# EAGLE design front-panel-module-revC (EAGLE 5.11)
DRAWN_BY: Alexios; PROJECT_NAME: CFT Mini-Computer; REVISION: Rev C; SHEET_DESCRIPTION: Front Panel LED Module; SIMULATION_FILENAME: N/A; URL: http://www.bedroomlan.org/cft
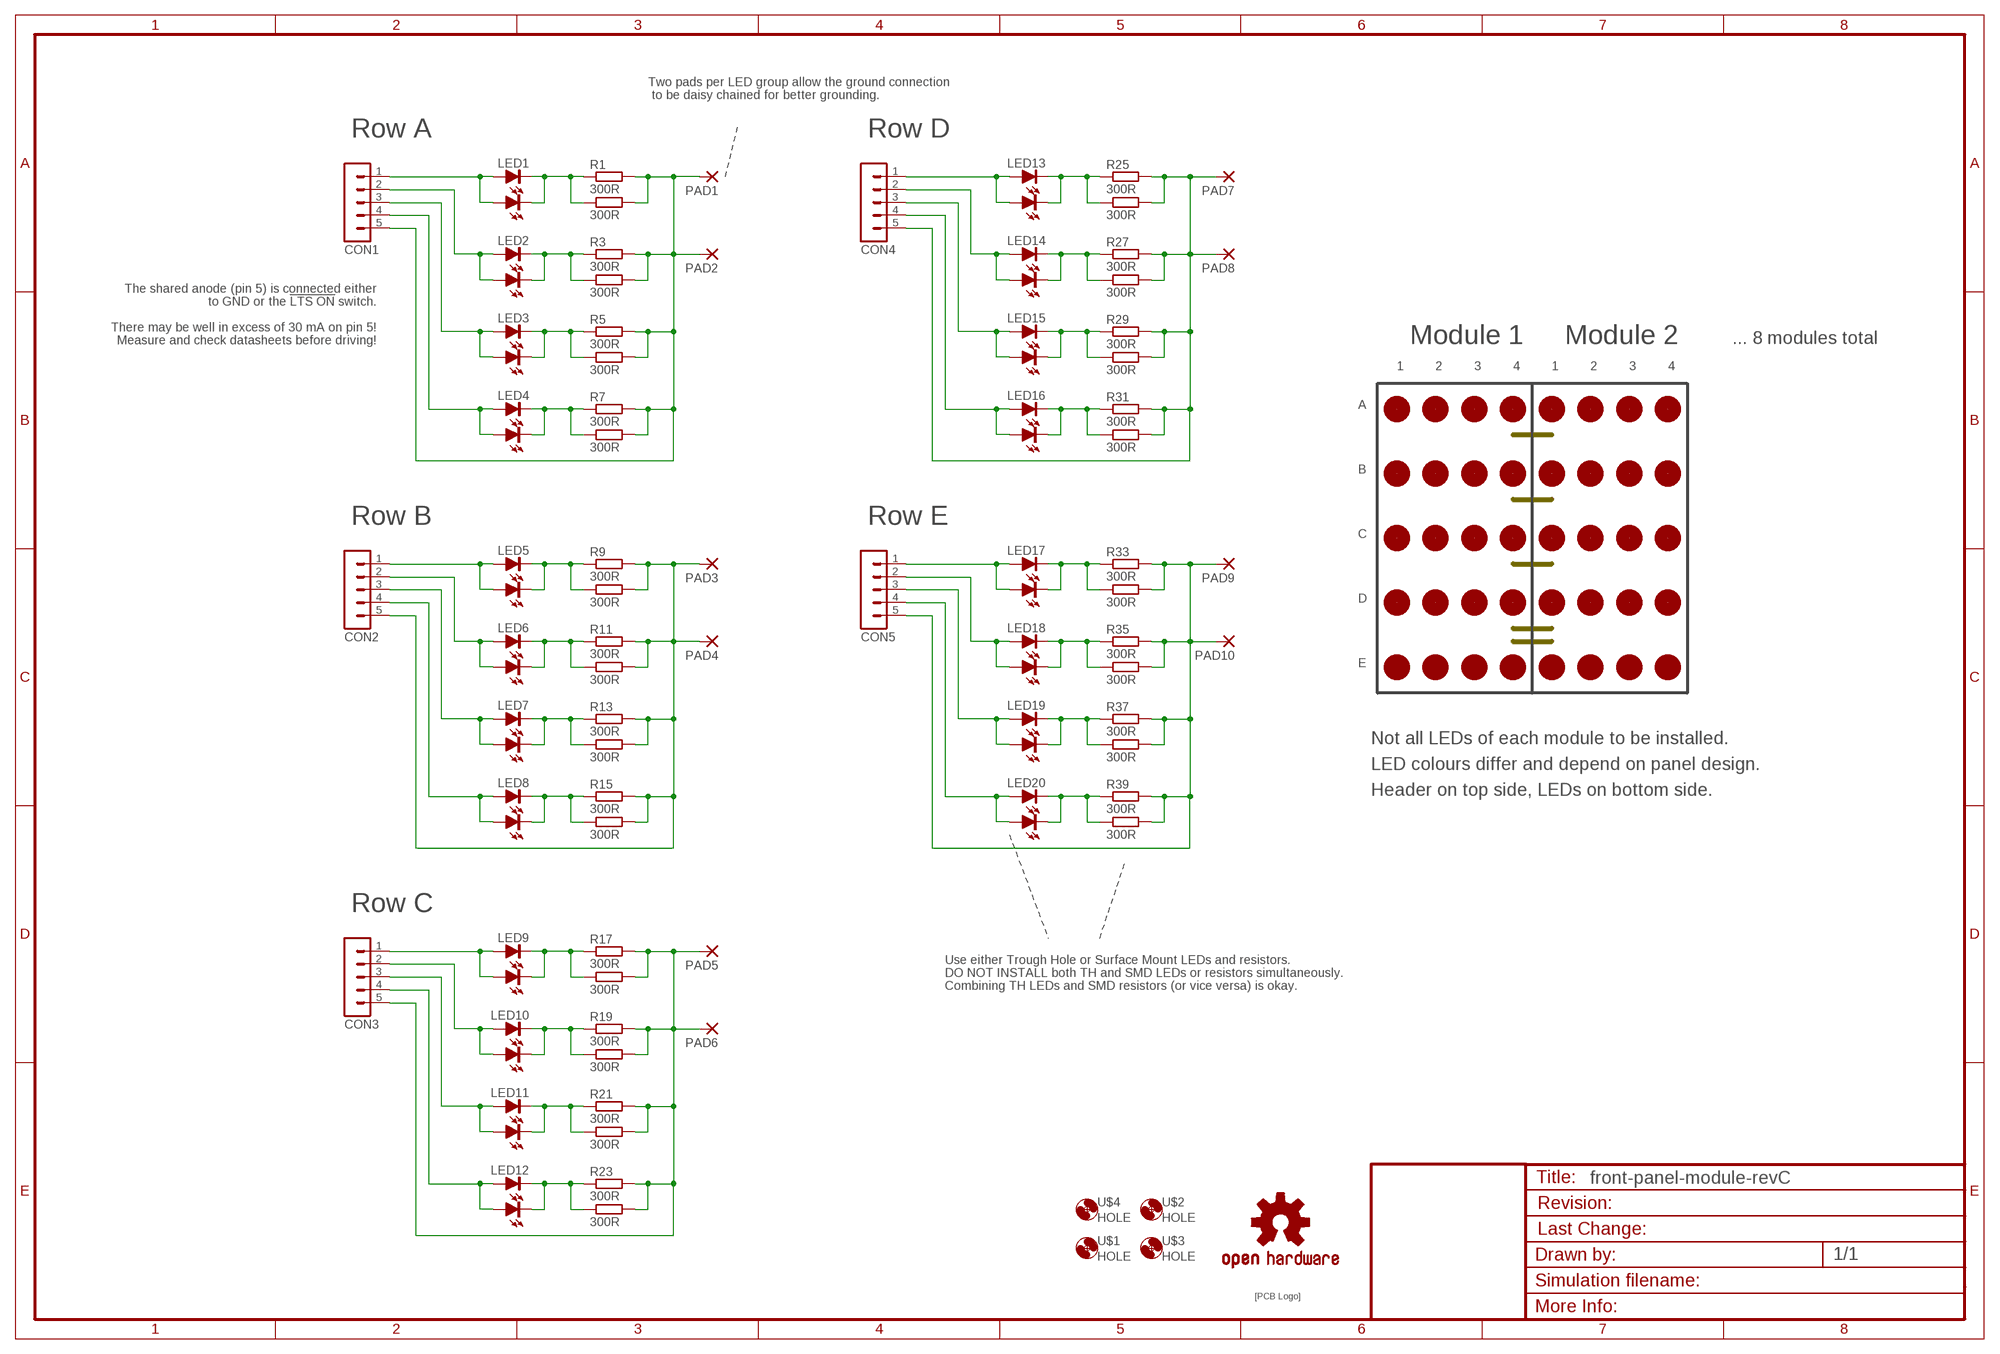
[diagram p0: schematic, sheet 1]

## Parts
$4_39_$  OSHW-LOGOL  [OSHW-LOGO-L]
CON1  MA05-1  [MA05-1]
CON2  MA05-1  [MA05-1]
CON3  MA05-1  [MA05-1]
CON4  MA05-1  [MA05-1]
CON5  MA05-1  [MA05-1]
LED1  LED-5MM-RED  [LED5MM@1]
LED1B  LEDKA-3528ASYC  [KA-3528ASYC]
LED2  LED-5MM-RED  [LED5MM@1]
LED2B  LEDKA-3528ASYC  [KA-3528ASYC]
LED3  LED-5MM-RED  [LED5MM@1]
LED3B  LEDKA-3528ASYC  [KA-3528ASYC]
LED4  LED-5MM-RED  [LED5MM@1]
LED4B  LEDKA-3528ASYC  [KA-3528ASYC]
LED5  LED-5MM-RED  [LED5MM@1]
LED5B  LEDKA-3528ASYC  [KA-3528ASYC]
LED6  LED-5MM-RED  [LED5MM@1]
LED6B  LEDKA-3528ASYC  [KA-3528ASYC]
LED7  LED-5MM-RED  [LED5MM@1]
LED7B  LEDKA-3528ASYC  [KA-3528ASYC]
LED8  LED-5MM-RED  [LED5MM@1]
LED8B  LEDKA-3528ASYC  [KA-3528ASYC]
LED9  LED-5MM-RED  [LED5MM@1]
LED9B  LEDKA-3528ASYC  [KA-3528ASYC]
LED10  LED-5MM-RED  [LED5MM@1]
LED10B  LEDKA-3528ASYC  [KA-3528ASYC]
LED11  LED-5MM-RED  [LED5MM@1]
LED11B  LEDKA-3528ASYC  [KA-3528ASYC]
LED12  LED-5MM-RED  [LED5MM@1]
LED12B  LEDKA-3528ASYC  [KA-3528ASYC]
LED13  LED-5MM-RED  [LED5MM@1]
LED13B  LEDKA-3528ASYC  [KA-3528ASYC]
LED14  LED-5MM-RED  [LED5MM@1]
LED14B  LEDKA-3528ASYC  [KA-3528ASYC]
LED15  LED-5MM-RED  [LED5MM@1]
LED15B  LEDKA-3528ASYC  [KA-3528ASYC]
LED16  LED-5MM-RED  [LED5MM@1]
LED16B  LEDKA-3528ASYC  [KA-3528ASYC]
LED17  LED-5MM-RED  [LED5MM@1]
LED17B  LEDKA-3528ASYC  [KA-3528ASYC]
LED18  LED-5MM-RED  [LED5MM@1]
LED18B  LEDKA-3528ASYC  [KA-3528ASYC]
LED19  LED-5MM-RED  [LED5MM@1]
LED19B  LEDKA-3528ASYC  [KA-3528ASYC]
LED20  LED-5MM-RED  [LED5MM@1]
LED20B  LEDKA-3528ASYC  [KA-3528ASYC]
PAD1  2,54/1,1  [2,54/1,1]
PAD2  2,54/1,1  [2,54/1,1]
PAD3  2,54/1,1  [2,54/1,1]
PAD4  2,54/1,1  [2,54/1,1]
PAD5  2,54/1,1  [2,54/1,1]
PAD6  2,54/1,1  [2,54/1,1]
PAD7  2,54/1,1  [2,54/1,1]
PAD8  2,54/1,1  [2,54/1,1]
PAD9  2,54/1,1  [2,54/1,1]
PAD10  2,54/1,1  [2,54/1,1]
R1  300R  R-EU_M0805  [M0805]
R2  300R  R-EU_0204/7  [0204/7]
R3  300R  R-EU_M0805  [M0805]
R4  300R  R-EU_0204/7  [0204/7]
R5  300R  R-EU_M0805  [M0805]
R6  300R  R-EU_0204/7  [0204/7]
R7  300R  R-EU_M0805  [M0805]
R8  300R  R-EU_0204/7  [0204/7]
R9  300R  R-EU_M0805  [M0805]
R10  300R  R-EU_0204/7  [0204/7]
R11  300R  R-EU_M0805  [M0805]
R12  300R  R-EU_0204/7  [0204/7]
R13  300R  R-EU_M0805  [M0805]
R14  300R  R-EU_0204/7  [0204/7]
R15  300R  R-EU_M0805  [M0805]
R16  300R  R-EU_0204/7  [0204/7]
R17  300R  R-EU_M0805  [M0805]
R18  300R  R-EU_0204/7  [0204/7]
R19  300R  R-EU_M0805  [M0805]
R20  300R  R-EU_0204/7  [0204/7]
R21  300R  R-EU_M0805  [M0805]
R22  300R  R-EU_0204/7  [0204/7]
R23  300R  R-EU_M0805  [M0805]
R24  300R  R-EU_0204/7  [0204/7]
R25  300R  R-EU_M0805  [M0805]
R26  300R  R-EU_0204/7  [0204/7]
R27  300R  R-EU_M0805  [M0805]
R28  300R  R-EU_0204/7  [0204/7]
R29  300R  R-EU_M0805  [M0805]
R30  300R  R-EU_0204/7  [0204/7]
R31  300R  R-EU_M0805  [M0805]
R32  300R  R-EU_0204/7  [0204/7]
R33  300R  R-EU_M0805  [M0805]
R34  300R  R-EU_0204/7  [0204/7]
R35  300R  R-EU_M0805  [M0805]
R36  300R  R-EU_0204/7  [0204/7]
R37  300R  R-EU_M0805  [M0805]
R38  300R  R-EU_0204/7  [0204/7]
R39  300R  R-EU_M0805  [M0805]
R40  300R  R-EU_0204/7  [0204/7]
U$1  HOLE  [STANDOFF_28_60]
U$2  HOLE  [STANDOFF_28_60]
U$3  HOLE  [STANDOFF_28_60]
U$4  HOLE  [STANDOFF_28_60]
U$6  SIGNATURESILK  [SIGNATURE]

## Nets
GND1: CON1.5 PAD1.1(P) PAD2.1(P) R1.2 R2.2 R3.2 R4.2 R5.2 R6.2 R7.2 R8.2
GND2: CON2.5 PAD3.1(P) PAD4.1(P) R9.2 R10.2 R11.2 R12.2 R13.2 R14.2 R15.2 R16.2
GND3: CON3.5 PAD5.1(P) PAD6.1(P) R17.2 R18.2 R19.2 R20.2 R21.2 R22.2 R23.2 R24.2
GND4: CON4.5 PAD7.1(P) PAD8.1(P) R25.2 R26.2 R27.2 R28.2 R29.2 R30.2 R31.2 R32.2
GND5: CON5.5 PAD9.1(P) PAD10.1(P) R33.2 R34.2 R35.2 R36.2 R37.2 R38.2 R39.2 R40.2
LED3B: LED3.K(C) LED3B.C R5.1 R6.1
LED4B: LED4.K(C) LED4B.C R7.1 R8.1
N$1: CON1.1 LED1.A LED1B.A
N$3: LED1.K(C) LED1B.C R1.1 R2.1
N$61: LED2.K(C) LED2B.C R3.1 R4.1
N$62: CON1.2 LED2.A LED2B.A
N$64: CON1.3 LED3.A LED3B.A
N$66: CON1.4 LED4.A LED4B.A
N$69: LED5.K(C) LED5B.C R9.1 R10.1
N$70: CON2.1 LED5.A LED5B.A
N$71: LED6.K(C) LED6B.C R11.1 R12.1
N$72: CON2.2 LED6.A LED6B.A
N$73: LED7.K(C) LED7B.C R13.1 R14.1
N$74: CON2.3 LED7.A LED7B.A
N$75: LED8.K(C) LED8B.C R15.1 R16.1
N$76: CON2.4 LED8.A LED8B.A
N$77: LED9.K(C) LED9B.C R17.1 R18.1
N$78: CON3.1 LED9.A LED9B.A
N$79: LED10.K(C) LED10B.C R19.1 R20.1
N$80: CON3.2 LED10.A LED10B.A
N$81: LED11.K(C) LED11B.C R21.1 R22.1
N$82: CON3.3 LED11.A LED11B.A
N$83: LED12.K(C) LED12B.C R23.1 R24.1
N$84: CON3.4 LED12.A LED12B.A
N$85: LED13.K(C) LED13B.C R25.1 R26.1
N$86: CON4.1 LED13.A LED13B.A
N$87: LED14.K(C) LED14B.C R27.1 R28.1
N$88: CON4.2 LED14.A LED14B.A
N$89: LED15.K(C) LED15B.C R29.1 R30.1
N$90: CON4.3 LED15.A LED15B.A
N$91: LED16.K(C) LED16B.C R31.1 R32.1
N$92: CON4.4 LED16.A LED16B.A
N$93: LED17.K(C) LED17B.C R33.1 R34.1
N$94: CON5.1 LED17.A LED17B.A
N$95: LED18.K(C) LED18B.C R35.1 R36.1
N$96: CON5.2 LED18.A LED18B.A
N$97: LED19.K(C) LED19B.C R37.1 R38.1
N$98: CON5.3 LED19.A LED19B.A
N$99: LED20.K(C) LED20B.C R39.1 R40.1
N$100: CON5.4 LED20.A LED20B.A

## Notes on the sheet
- Two pads per LED group allow the ground connection
- to be daisy chained for better grounding.
- Row A | Row D
- The shared anode (pin 5) is connected either
- to GND or the !LTS ON! switch.
- There may be well in excess of 30 mA on pin 5!
- Measure and check datasheets before driving! | Module 1 | Module 2 | ... 8 modules total
- 1 | 2 | 3 | 4 | 1 | 2 | 3 | 4
- A
- B
- Row B | Row E
- C
- D
- E
- Not all LEDs of each module to be installed.
- LED colours differ and depend on panel design.
- Header on top side, LEDs on bottom side.
- Row C
- Use either Trough Hole or Surface Mount LEDs and resistors.
- DO NOT INSTALL both TH and SMD LEDs or resistors simultaneously.
- Combining TH LEDs and SMD resistors (or vice versa) is okay.

## Library data of the parts
$4_39_$ = SparkFun:OSHW-LOGO: Open Source Hardware Logo This logo indicates the piece of hardware it is found on incorporates a OSHW license and/or adheres to the definition of open source hardware found here: http://freedomdefined.org/OSHW
CON1-CON5 = con-lstb:MA05-1: PIN HEADER; OC_FARNELL: unknown; OC_NEWARK: unknown
LED1-LED20 = alexios:LED-5MM: 5mm LED Standard 5mm LED with filled in diode outline and colour options for the sake of generating bills of materials.
LED1B LED2B LED3B LED4B LED5B LED6B LED7B LED8B LED9B LED10B LED11B LED12B LED13B LED14B LED15B LED16B LED17B LED18B LED19B LED20B = alexios:LED: LED OSRAM: - CHIPLED LG R971, LG N971, LY N971, LG Q971, LY Q971, LO R971, LY R971 LH N974, LH R974 LS Q976, LO Q976, LY Q976 LO Q996 - Hyper CHIPLED LW Q18S LB Q993, LB Q99A, LB R99A - SideLED LS A670, LO A670, LY A670, LG A670, LP A670 LB A673, LV A673, LT A673, LW A673 LH A674 LY A675 LS A676, LA A676, LO A676, LY A676, LW A676 LS A679, LY A679, LG A679 - Hyper Micro SIDELED® LS Y876, LA Y876, LO Y876, LY Y876 LT Y87S - SmartLED LW L88C, LW L88S LB L89C, LB L89S, LG L890 LS L89K, LO L89K, LY L89K LS L896, LA L896, LO L896, LY L896 - TOPLED LS T670, LO T670, LY T670, LG T670, LP T670 LSG T670, LSP T670, LSY T670, LOP T670, LYG T670 LG T671, LOG T671, LSG T671 LB T673, LV T673, LT T673, LW T673 LH T674 LS T676, LA T676, LO T676, LY T676, LB T676, LH T676, LSB T676, LW T676 LB T67C, LV T67C, LT T67C, LS T67K, LO T67K, LY T67K, LW E67C LS E67B, LA E67B, LO E67B, LY E67B, LB E67C, LV E67C, LT E67C LW T67C LS T679, LY T679, LG T679 LS T770, LO T770, LY T770, LG T770, LP T770 LB T773, LV T773, LT T773, LW T773 LH T774 LS E675, LA E675, LY E675, LS T675 LS T776, LA T776, LO T776, LY T776, LB T776 LHGB T686 LT T68C, LB T68C - Hyper Mini TOPLED® LB M676 - Mini TOPLED Santana® LG M470 LS M47K, LO M47K, LY M47K Source: http://www.osram.convergy.de LUXEON: - LUMILED® LXK2-PW12-R00, LXK2-PW12-S00, LXK2-PW14-U00, LXK2-PW14-V00 LXK2-PM12-R00, LXK2-PM12-S00, LXK2-PM14-U00 LXK2-PE12-Q00, LXK2-PE12-R00, LXK2-PE12-S00, LXK2-PE14-T00, LXK2-PE14-U00 LXK2-PB12-K00, LXK2-PB12-L00, LXK2-PB12-M00, LXK2-PB14-N00, LXK2-PB14-P00, LXK2-PB14-Q00 LXK2-PR12-L00, LXK2-PR12-M00, LXK2-PR14-Q00, LXK2-PR14-R00 LXK2-PD12-Q00, LXK2-PD12-R00, LXK2-PD12-S00 LXK2-PH12-R00, LXK2-PH12-S00 LXK2-PL12-P00, LXK2-PL12-Q00, LXK2-PL12-R00 Source: www.luxeon.com KINGBRIGHT: KA-3528ASYC Source: www.kingbright.com
PAD1-PAD10 = wirepad:2,54/1,1: THROUGH-HOLE PAD
R1-R40 = resistor:R-EU_: RESISTOR, European symbol
U$1-U$4 = alexios:HOLE: Hole for a standoff or mount. Hole diameter: 3.3mm. External Diameter: 6mm.
U$6 = alexios:SIGNATURE: Soup signature

## Net classes
0 default: width 0.305 mm, clearance 0.254 mm

## Board
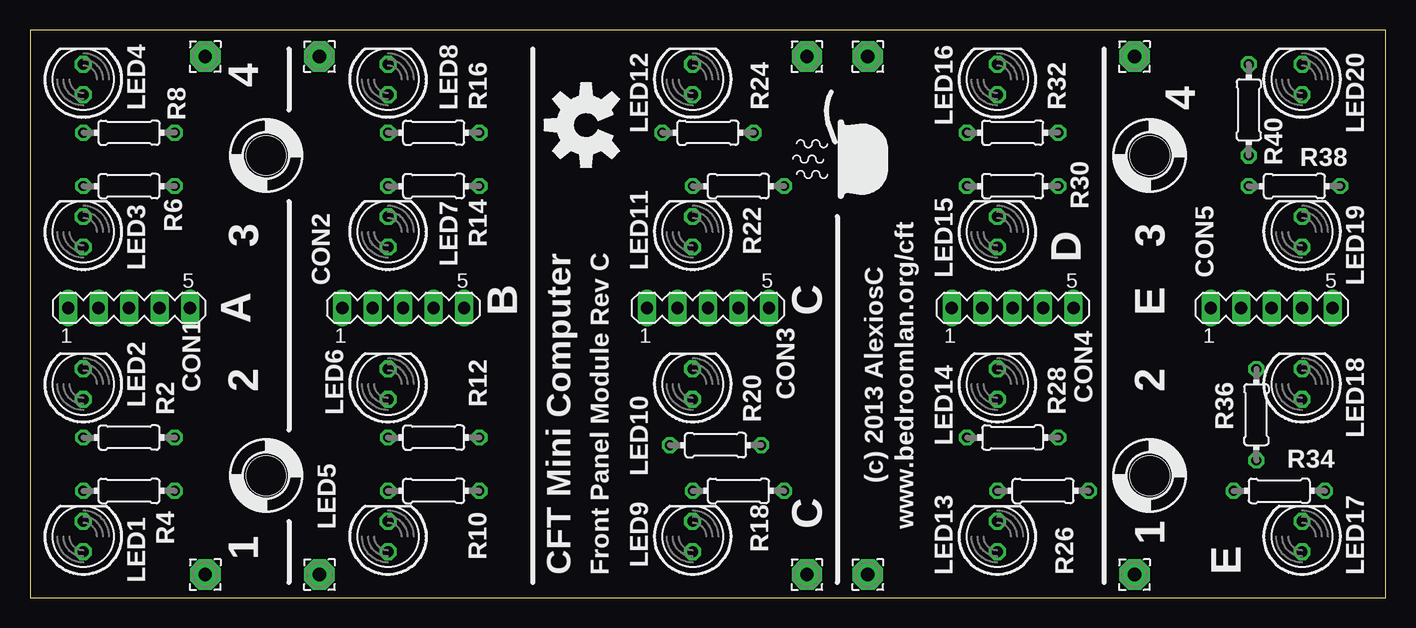
[diagram p1: board, top side]
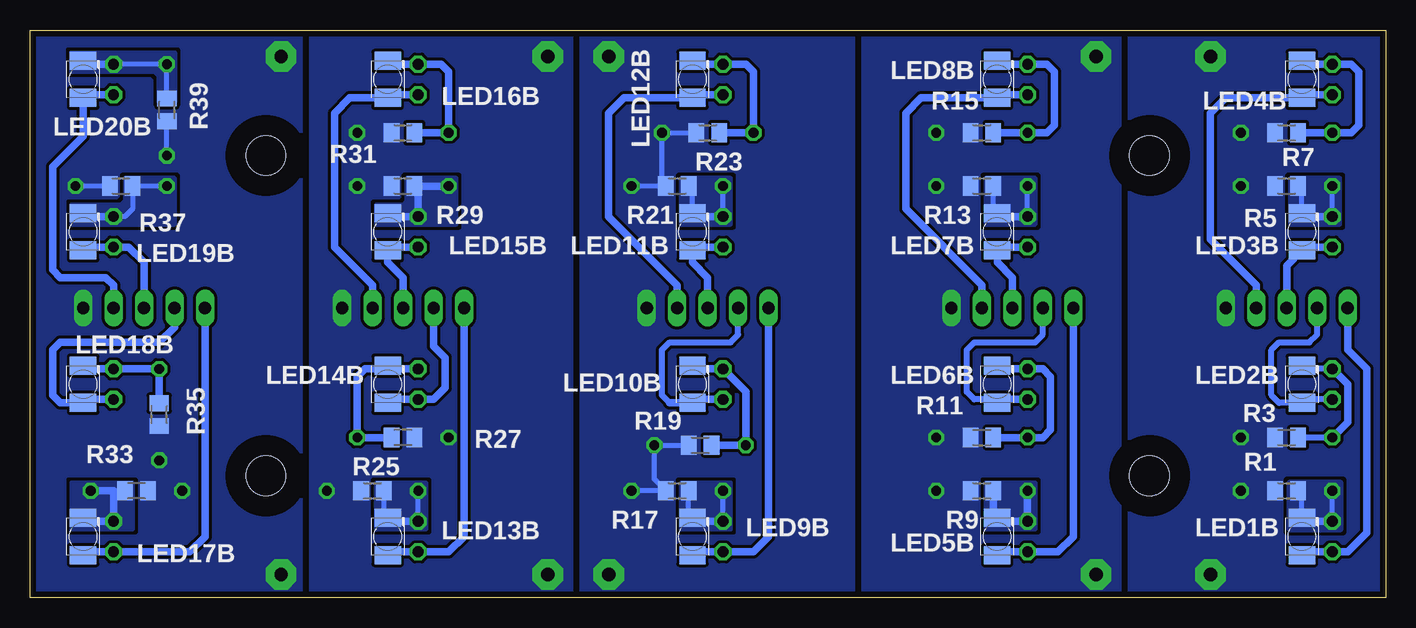
[diagram p2: board, bottom side, seen from below]

Size 113.01 x 47.3 mm. Coordinates in mm from the lower left corner, seen from the top.
Outline: 0,0 113.01,0 113.01,47.3 0,47.3 0,0
Copper layers (1*16): Top 0.035mm / dielectric 1.5mm / Bottom 0.035mm
Design rules "smart-prototyping *": minimum track width 7mil, minimum drill 12mil, track to track 7mil, track to pad 7mil, pad to pad 7mil, via to via 7mil, smd to smd 0mil, copper to edge 20mil, drill to drill 10mil, minimum pad ring 10mil, minimum via ring 6mil, stop-mask expansion 2mil, vias tented up to drill 25mil, thermal gap 10mil

### Footprints (pad centres in the part's own frame; a part is rotated, then mirrored left to right if it is on the bottom)
MA05-1 = drill 1.016 long: 1 -5.08,0; 2 -2.54,0; 3 0,0; 4 2.54,0; 5 5.08,0
LED5MM@1 = drill 0.9 octagon: A -1.27,0; K 1.27,0
KA-3528ASYC = smd 1.5 x 2.2: A -1.55,0; C 1.55,0
2,54/1,1 = drill 1.118 pad 2.54 octagon: 1 0,0
M0805 = smd 1.3 x 1.6: 1 -0.95,0; 2 0.95,0
0204/7 = drill 0.813 octagon: 1 -3.81,0; 2 3.81,0
STANDOFF_28_60 = hole 3.302: 0,0

### Placement (x,y rotation side)
$4_39_$  46.35,39.37 90 top
CON1  8.26,24.13 0 top
CON2  31.11,24.13 0 top
CON3  56.52,24.13 0 top
CON4  81.92,24.13 0 top
CON5  103.5,24.13 0 top
LED1  4.45,5.08 90 top
LED1B  6.99,5.08 90 bottom
LED2  4.45,17.78 90 top
LED2B  6.99,17.78 90 bottom
LED3  4.45,30.48 90 top
LED3B  6.99,30.48 90 bottom
LED4  4.45,43.18 90 top
LED4B  6.99,43.18 90 bottom
LED5  29.84,5.08 90 top
LED5B  32.38,5.08 90 bottom
LED6  29.84,17.78 90 top
LED6B  32.38,17.78 90 bottom
LED7  29.84,30.48 90 top
LED7B  32.38,30.48 90 bottom
LED8  29.84,43.18 90 top
LED8B  32.38,43.18 90 bottom
LED9  55.24,5.08 90 top
LED9B  57.78,5.08 90 bottom
LED10  55.24,17.78 90 top
LED10B  57.78,17.78 90 bottom
LED11  55.24,30.48 90 top
LED11B  57.78,30.48 90 bottom
LED12  55.24,43.18 90 top
LED12B  57.78,43.18 90 bottom
LED13  80.64,5.08 90 top
LED13B  83.19,5.08 90 bottom
LED14  80.64,17.78 90 top
LED14B  83.19,17.78 90 bottom
LED15  80.64,30.48 90 top
LED15B  83.19,30.48 90 bottom
LED16  80.64,43.18 90 top
LED16B  83.19,43.18 90 bottom
LED17  106.05,5.08 90 top
LED17B  108.58,5.08 90 bottom
LED18  106.05,17.78 90 top
LED18B  108.58,17.78 90 bottom
LED19  106.05,30.48 90 top
LED19B  108.58,30.48 90 bottom
LED20  106.05,43.18 90 top
LED20B  108.58,43.18 90 bottom
PAD1  14.61,1.91 0 top
PAD2  14.61,45.09 0 top
PAD3  24.13,45.09 0 top
PAD4  24.13,1.91 0 top
PAD5  64.77,45.09 0 top
PAD6  64.77,1.91 0 top
PAD7  69.85,1.91 0 top
PAD8  69.85,45.09 0 top
PAD9  92.08,1.91 0 top
PAD10  92.08,45.09 0 top
R1  8.26,8.89 180 bottom
R2  8.26,8.89 0 top
R3  8.26,13.34 180 bottom
R4  8.26,13.34 0 top
R5  8.26,34.29 180 bottom
R6  8.26,34.29 0 top
R7  8.26,38.73 180 bottom
R8  8.26,38.73 0 top
R9  33.66,8.89 180 bottom
R10  33.66,8.89 0 top
R11  33.66,13.34 180 bottom
R12  33.66,13.34 0 top
R13  33.66,34.29 180 bottom
R14  33.66,34.29 0 top
R15  33.66,38.73 180 bottom
R16  33.66,38.73 0 top
R17  59.05,8.89 180 bottom
R18  59.05,8.89 0 top
R19  57.15,12.7 180 bottom
R20  57.15,12.7 0 top
R21  59.05,34.29 180 bottom
R22  59.05,34.29 0 top
R23  56.52,38.73 180 bottom
R24  56.52,38.73 0 top
R25  84.45,8.89 180 bottom
R26  84.45,8.89 0 top
R27  81.92,13.34 0 bottom
R28  81.92,13.34 180 top
R29  81.92,34.29 180 bottom
R30  81.92,34.29 0 top
R31  81.92,38.73 180 bottom
R32  81.92,38.73 0 top
R33  104.14,8.89 0 bottom
R34  104.14,8.89 180 top
R35  102.23,15.24 270 bottom
R36  102.23,15.24 270 top
R37  105.41,34.29 180 bottom
R38  105.41,34.29 0 top
R39  101.6,40.64 270 bottom
R40  101.6,40.64 270 top
U$1  93.34,36.83 0 top
U$2  19.68,10.16 0 top
U$3  19.68,36.83 0 top
U$4  93.34,10.16 0 top
U$6  71.75,33.66 90 top

### Tracks (layer width: path | path; a pad name or v marks a point on that pad's centre or on a via)
GND1
  pour Bottom (isolate 0.254, rank 3, no thermals): 0,46.99 0,0 21.27,0 21.27,46.99
GND2
  pour Bottom (isolate 0.254, rank 3, no thermals): 22.23,46.99 22.23,0 43.5,0 43.5,46.99
GND3
  Bottom 0.406: R23.2 R24.2 60.33,34.61 R21.2 R22.2 | R19.2 R20.2 60.96,9.85 R17.2 R18.2
  pour Bottom (isolate 0.254, rank 3, no thermals): 44.45,46.99 44.45,0 66.99,0 66.99,46.99
GND4
  pour Bottom (isolate 0.254, rank 3, no thermals): 67.94,46.99 67.94,0 89.53,0 89.53,46.99
GND5
  Bottom 0.406: R40.2 R39.2 | R37.2 R38.2
  pour Bottom (isolate 0.254, rank 3, no thermals): 90.49,46.99 90.49,0 113.03,0 113.03,46.99
LED3B
  Bottom 0.406: R5.1 6.99,33.97 LED3B.C | LED3.K R6.1
  Bottom 0.61: LED3.K 6.71,31.75 LED3B.C
  pour Bottom (isolate 0.254, no thermals): 3.81,34.92 7.94,34.92 7.94,31.11 3.81,31.11
LED4B
  Bottom 0.406: 6.71,44.45 LED4B.C
  Bottom 0.61: 6.71,44.45 LED4.K 2.86,44.45 2.22,43.81 2.22,39.37 2.86,38.73 R8.1 R7.1
N$1
  Bottom 0.61: LED1B.A 6.71,3.81 LED1.A 3.17,3.81 1.59,5.4 1.59,19.05 3.17,20.64 CON1.1
N$3
  Bottom 0.406: LED1.K R2.1 | R1.1 6.99,8.57 LED1B.C
  Bottom 0.61: LED1.K 6.71,6.35 LED1B.C
  pour Bottom (isolate 0.254, no thermals): 3.81,9.53 7.94,9.53 7.94,5.71 3.81,5.71
N$61
  Bottom 0.508: LED2.K 6.71,19.05 | R4.1 R3.1
  Bottom 0.61: 6.71,19.05 LED2B.C | LED2.K 3.17,17.78 3.17,14.61 R4.1
N$62
  Bottom 0.508: LED2.A 6.71,16.51 | LED2B.A 8.89,16.23 9.53,16.86 9.53,20.64 8.89,21.27 6.35,21.27 5.71,21.91 CON1.2
  Bottom 0.61: 6.71,16.51 LED2B.A
N$64
  Bottom 0.61: LED3.A 6.71,29.21 LED3B.A 8.26,27.66 CON1.3
N$66
  Bottom 0.406: LED4B.A 6.71,41.91
  Bottom 0.61: 6.71,41.91 LED4.A | LED4B.A 13.34,41.63 14.61,40.36 14.61,29.84 10.79,26.04 CON1.4
N$69
  Bottom 0.406: LED5B.C 32.7,6.63
  Bottom 0.61: LED5B.C 32.1,6.35 LED5.K R10.1 | 32.7,6.63 R9.1
  pour Bottom (isolate 0.254, no thermals): 29.21,9.53 33.34,9.53 33.34,5.71 29.21,5.71
N$70
  Bottom 0.61: LED5B.A 32.1,3.81 LED5.A 27.3,3.81 26.04,5.08 CON2.1
N$71
  Bottom 0.61: LED6B.C 32.1,19.05 LED6.K 28.57,19.05 27.94,18.41 27.94,13.97 28.57,13.34 R12.1 R11.1
N$72
  Bottom 0.508: LED6.A 34.29,16.51 34.92,17.14 34.92,20.64 34.29,21.27 29.21,21.27 28.57,21.91 CON2.2
  Bottom 0.61: LED6.A 32.1,16.51 LED6B.A
N$73
  Bottom 0.406: R13.1 32.7,32.35 LED7B.C | LED7.K R14.1
  Bottom 0.61: LED7.K 32.1,31.75 LED7B.C
  pour Bottom (isolate 0.254, no thermals): 29.21,34.92 33.34,34.92 33.34,31.11 29.21,31.11
N$74
  Bottom 0.61: LED7.A 32.1,29.21 LED7B.A 32.38,27.94 31.11,26.67 CON2.3
N$75
  Bottom 0.406: 32.1,44.45 LED8B.C
  Bottom 0.61: 32.1,44.45 LED8.K 28.26,44.45 27.62,43.81 27.62,39.37 28.26,38.73 R16.1 R15.1
N$76
  Bottom 0.406: LED8B.A 32.1,41.91
  Bottom 0.61: 32.1,41.91 LED8.A | CON2.4 33.66,26.04 40.01,32.38 40.01,40.36 38.73,41.63 LED8B.A
N$77
  Bottom 0.406: R17.1 58.1,6.95 LED9B.C | LED9.K R18.1
  Bottom 0.61: LED9.K 57.51,6.35 LED9B.C
  pour Bottom (isolate 0.254, no thermals): 54.61,9.53 58.74,9.53 58.74,5.71 54.61,5.71
N$78
  Bottom 0.61: LED9B.A 57.51,3.81 LED9.A 52.7,3.81 51.44,5.08 CON3.1
N$79
  Bottom 0.61: LED10B.C 57.51,19.05 LED10.K 53.34,17.14 R20.1 R19.1
N$80
  Bottom 0.508: CON3.2 53.98,21.91 54.61,21.27 59.69,21.27 60.33,20.64 60.33,16.86 59.69,16.23
  Bottom 0.61: LED10.A 57.51,16.51 LED10B.A 59.69,16.23
N$81
  Bottom 0.406: LED11.K R22.1 | R21.1 57.78,33.97 LED11B.C
  Bottom 0.61: LED11.K 57.51,31.75 LED11B.C
  pour Bottom (isolate 0.254, no thermals): 54.61,34.92 58.74,34.92 58.74,31.11 54.61,31.11
N$82
  Bottom 0.61: LED11.A 57.51,29.21 LED11B.A 57.78,27.94 56.52,26.67 CON3.3
N$83
  Bottom 0.61: LED12B.C 57.51,44.45 LED12.K 53.34,44.45 52.7,43.81 R24.1 R23.1
N$84
  Bottom 0.61: LED12.A 57.51,41.91 LED12B.A 63.5,41.63 64.77,40.36 64.77,31.75 59.05,26.04 CON3.4
N$85
  Bottom 0.406: LED13.K R26.1 | R25.1 83.5,6.63 LED13B.C
  Bottom 0.61: LED13.K 82.91,6.35 LED13B.C
  pour Bottom (isolate 0.254, no thermals): 80.01,9.53 84.14,9.53 84.14,5.71 80.01,5.71
N$86
  Bottom 0.61: 81.28,3.81 LED13.A | 81.28,3.81 82.91,3.81 LED13B.A | CON4.1 76.83,5.08 78.11,3.81 81.28,3.81
N$87
  Bottom 0.61: 82.91,19.05 LED14.K | 82.91,19.05 LED14B.C | R27.1 R28.1 85.72,17.14 85.72,17.78 85.72,18.41 85.09,19.05 82.91,19.05
N$88
  Bottom 0.61: LED14B.A 82.91,16.51 LED14.A 79.38,16.51 78.42,17.46 78.42,20 79.38,20.95 CON4.2
N$89
  Bottom 0.406: R29.1 80.64,33.97
  Bottom 0.61: LED15B.C 82.91,31.75 LED15.K 80.64,33.97 | R30.1 R29.1
  pour Bottom (isolate 0.254, no thermals): 77.47,34.92 81.6,34.92 81.6,33.02 81.92,32.7 84.14,32.7 84.14,31.11 77.47,31.11
N$90
  Bottom 0.61: LED15.A 82.91,29.21 LED15B.A 83.19,27.94 81.92,26.67 CON4.3
N$91
  Bottom 0.61: LED16B.C 82.91,44.45 LED16.K 78.74,44.45 78.11,43.81 R32.1 R31.1
N$92
  Bottom 0.61: LED16.A 82.91,41.91 LED16B.A 86.36,41.63 87.63,40.36 87.63,29.21 84.45,26.04 CON4.4
N$93
  Bottom 0.406: R34.1 R33.1
  Bottom 0.61: LED17B.C 108.31,6.35 LED17.K 106.05,8.89 R34.1
  pour Bottom (isolate 0.254, no thermals): 104.46,9.53 109.54,9.53 109.54,5.71 104.46,5.71
N$94
  Bottom 0.61: 106.68,3.81 LED17.A | 106.68,3.81 108.31,3.81 LED17B.A | CON5.1 98.42,5.08 99.69,3.81 106.68,3.81
N$95
  Bottom 0.406: R35.1 102.23,16.51
  Bottom 0.61: LED18B.C 108.31,19.05 LED18.K R36.1 R35.1
N$96
  Bottom 0.61: LED18.A 108.31,16.51 LED18B.A 110.49,16.23 111.12,16.86 111.12,20.64 110.49,21.27 102.23,21.27 100.97,22.54 CON5.2
N$97
  Bottom 0.406: R38.1 R37.1 104.46,32.38 105.09,31.75 LED19.K
  Bottom 0.61: LED19.K 108.31,31.75 LED19B.C
  pour Bottom (isolate 0.254, no thermals): 100.97,34.92 105.09,34.92 105.09,33.02 105.41,32.7 109.54,32.7 109.54,31.11 100.97,31.11
N$98
  Bottom 0.61: LED19B.A 108.31,29.21 LED19.A 104.78,29.21 103.5,27.94 CON5.3
N$99
  Bottom 0.406: LED20.K R40.1 R39.1
  Bottom 0.61: LED20.K 108.58,44.45 LED20B.C
  pour Bottom (isolate 0.254, no thermals): 100.97,41.27 102.23,41.27 102.23,43.5 102.55,43.81 109.54,43.81 109.54,45.4 100.97,45.4
N$100
  Bottom 0.61: LED20.A 108.31,41.91 LED20B.A 108.58,38.45 111.12,35.91 111.12,27.3 110.49,26.67 106.68,26.67 106.05,26.04 CON5.4

### Text on the board
tNames: 4 | 4 | 3 | 3 | D | A | B | C | E | 2 | 2 | (c) 2013 AlexiosC | C | www.bedroomlan.org/cft | 1 | 1 | CFT Mini Computer | Front Panel Module Rev C | E